# EAGLE schematic 808_handclap (EAGLE 7.6.0)
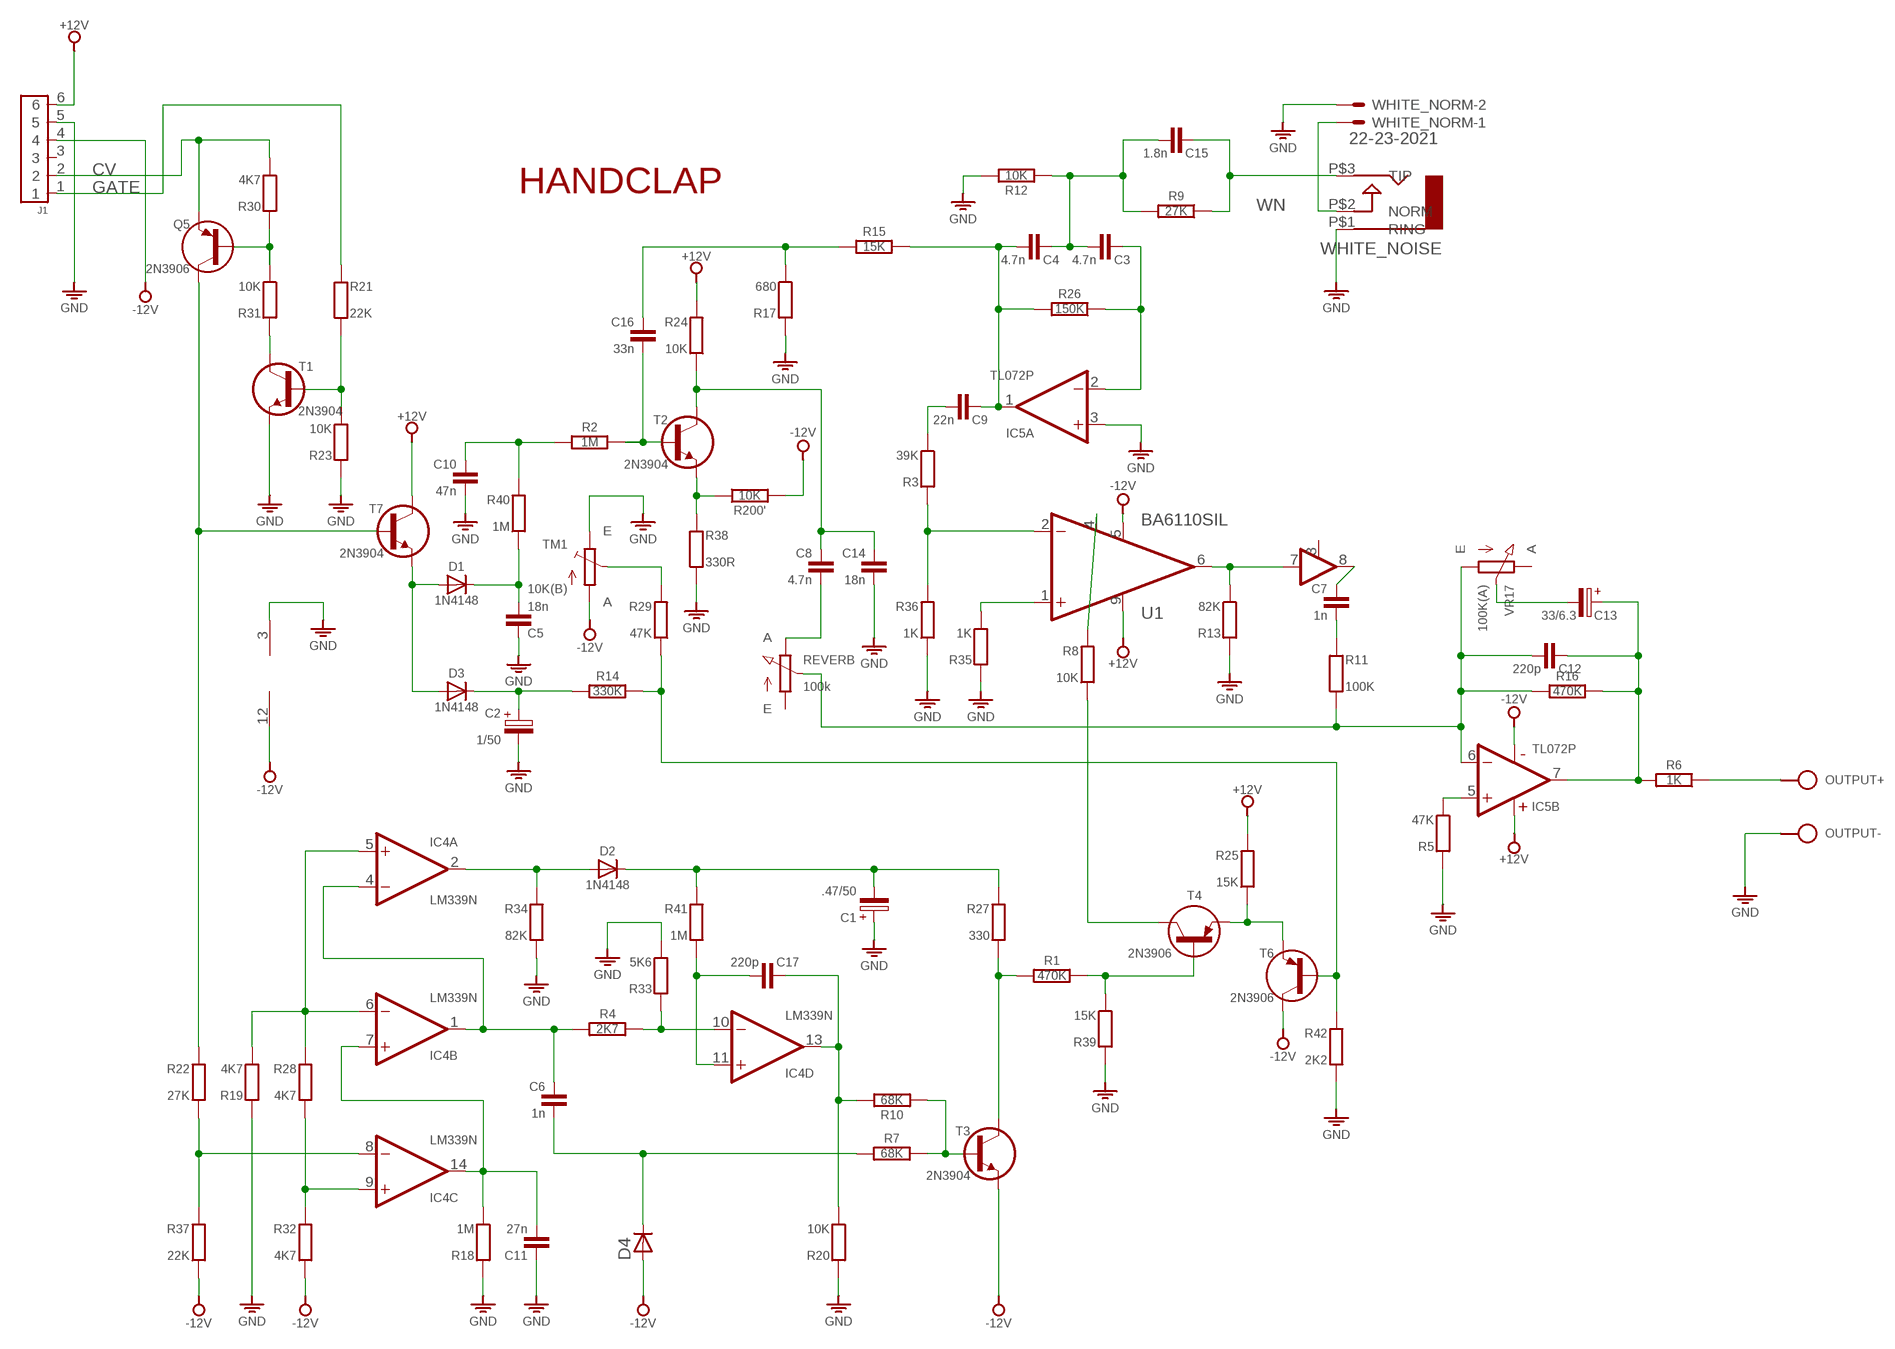
[diagram p0: schematic, sheet 1]

## Parts
C1  .47/50  CPOLE2,5-3/V  [E2,5-3/V]
C2  1/50  CPOLE2,5-4/V  [E2.5-4/V]
C3  4.7n  C-H050-020X044  [C050-020X044]
C4  4.7n  C-H050-020X044  [C050-020X044]
C5  18n  C050-020X044/V  [C050-020X044/V]
C6  1n  C050-020X044/V  [C050-020X044/V]
C7  1n  C050-020X044/V  [C050-020X044/V]
C8  4.7n  C050-020X044/V  [C050-020X044/V]
C9  22n  C-H050-020X044  [C050-020X044]
C10  47n  C050-020X044/V  [C050-020X044/V]
C11  27n  C050-020X044/V  [C050-020X044/V]
C12  220p  C-H050-020X044  [C050-020X044]
C13  33/6.3  CPOL-HE2,5-3  [E2,5-3]
C14  18n  C050-020X044/V  [C050-020X044/V]
C15  1.8n  C-H050-020X044  [C050-020X044]
C16  33n  C050-020X044/V  [C050-020X044/V]
C17  220p  C-H050-020X044  [C050-020X044]
D1  1N4148  DIODE-HDO34-10  [DO34-10]
D2  1N4148  DIODE-HDO34-10  [DO34-10]
D3  1N4148  DIODE-HDO34-10  [DO34-10]
D4  1N4148DO35-7  [DO35-7]
IC3  LM339N  [DIL14]
IC4  LM339N  [DIL14]
IC5  TL072P  [DIL08]
J1  CONN-6P  [CONN-6P]
OUTPUT  SPAD+-+-  [SPAD+-]
Q5  2N3906  [TO92]
R1  470K  R-H0204/10  [0204/10]
R2  1M  R-H0204/10  [0204/10]
R3  39K  R0204/10-V  [0204/10-V]
R4  2K7  R-H0204/10  [0204/10]
R5  47K  R0204/10-V  [0204/10-V]
R6  1K  R-H0204/10  [0204/10]
R7  68K  R-H0204/10  [0204/10]
R8  10K  R0204/10-V  [0204/10-V]
R9  27K  R-H0204/10  [0204/10]
R10  68K  R-H0204/10  [0204/10]
R11  100K  R0204/10-V  [0204/10-V]
R12  10K  R-H0204/10  [0204/10]
R13  82K  R0204/10-V  [0204/10-V]
R14  330K  R-H0204/10  [0204/10]
R15  15K  R-H0204/10  [0204/10]
R16  470K  R-H0204/10  [0204/10]
R17  680  R0204/10-V  [0204/10-V]
R18  1M  R0204/10-V  [0204/10-V]
R19  4K7  R0204/10-V  [0204/10-V]
R20  10K  R0204/10-V  [0204/10-V]
R21  22K  R0204/10-V  [0204/10-V]
R22  27K  R0204/10-V  [0204/10-V]
R23  10K  R0204/10-V  [0204/10-V]
R24  10K  R0204/10-V  [0204/10-V]
R25  15K  R0204/10-V  [0204/10-V]
R26  150K  R-H0204/10  [0204/10]
R27  330  R0204/10-V  [0204/10-V]
R28  4K7  R0204/10-V  [0204/10-V]
R29  47K  R0204/10-V  [0204/10-V]
R30  4K7  R0204/10-V  [0204/10-V]
R31  10K  R0204/10-V  [0204/10-V]
R32  4K7  R0204/10-V  [0204/10-V]
R33  5K6  R0204/10-V  [0204/10-V]
R34  82K  R0204/10-V  [0204/10-V]
R35  1K  R0204/10-V  [0204/10-V]
R36  1K  R0204/10-V  [0204/10-V]
R37  22K  R0204/10-V  [0204/10-V]
R38  330R  R0204/10-V  [0204/10-V]
R39  15K  R0204/10-V  [0204/10-V]
R40  1M  R0204/10-V  [0204/10-V]
R41  1M  R0204/10-V  [0204/10-V]
R42  2K2  R0204/10-V  [0204/10-V]
R200'  10K  R-H0204/10  [0204/10]
REVERB  100k  POT  [POT]
T1  2N3904  [TO92]
T2  2N3904  [TO92]
T3  2N3904  [TO92]
T4  2N3906  2N3906-H  [TO92]
T6  2N3906  [TO92]
T7  2N3904  [TO92]
TM1  10K(B)  TRIMR-TRIM  [R-TRIM]
U1  BA6110SIL  [SIL09]
VR17  100K(A)  POT  [POT]
WHITE_NOISE  AUDIO-JACK  [ERTHENVAR-JACK-90DEG]
WHITE_NORM  22-23-2021  [22-23-2021]

## Nets
+12V [Power]: IC5.8(P:V+) J1.6 R24.1 R25.1 T7.3(C) U1.9(V+)
-12V: D4.A IC3.12(P:GND) IC5.4(P:V-) J1.4 R32.2 R37.2 R200'.2 T3.1(E) T6.3(C) TM1.1(A) U1.5(V-)
CV: J1.2 Q5.1(E) R30.2
GATE: J1.1 R21.1
GND [GND]: C1.+ C2.- C5.1 C10.2 C11.1 C14.2 IC3.3(P:V+) IC5.3(A:+IN) J1.5 OUTPUT.1 R5.1 R12.1 R13.1 R17.1 R18.1 R19.1 R20.1 R23.1 R33.2 R34.2 R35.1 R36.2 R38.2 R39.1 R42.2 T1.1(E) TM1.3(E) WHITE_NOISE.P$1(RING) WHITE_NORM.2
N$1: OUTPUT.2 R6.1
N$2: WHITE_NOISE.P$2(NORM) WHITE_NORM.1
N$3: R31.1 T1.3(C)
N$4: R21.2 R23.2 T1.2(B)
N$10: C4.2 C9.1 IC5.1(A:OUT) R15.1 R26.2
N$37: Q5.2(B) R30.1 R31.2
N$40: C16.2 R2.1 T2.2(B)
N$41: C5.2 D1.C R40.2
N$42: R38.1 R200'.1 T2.1(E)
N$43: Q5.3(C) R22.1 T7.2(B)
N$44: D1.A D3.A T7.1(E)
N$45: C10.1 R2.2 R40.1
N$46: C8.1 C14.1 R24.2 T2.3(C)
N$47: C2.+ D3.C R14.2
N$48: R14.1 R29.2 R42.1 T6.2(B)
N$49: R29.1 TM1.2(S)
N$50: C16.1 R15.2 R17.2
N$51: D2.A IC4.2(A:OUT) R34.1
N$52: C3.2 C4.1 C15.2 R9.2 R12.2
N$54: C3.1 IC5.2(A:-IN) R26.1
N$55: C9.2 R3.2
N$56: R3.1 R36.1 U1.2(-IN)
N$57: C8.2 REVERB.E
N$59: R35.2 U1.1(+IN)
N$60: R8.1 U1.4(C)
N$61: R13.2 U1.6(OUT) U1.7(IN1)
N$62: C7.2 R11.1
N$63 [special]: C7.1 U1.8(OUT1)
N$64: IC4.5(A:+IN) IC4.6(B:-IN) R19.2 R28.1
N$65: C1.- D2.C R27.1 R41.1
N$66: R1.1 R39.2 T4.2(B)
N$67: R25.2 T4.1(E) T6.1(E)
N$68: C6.1 IC4.1(B:OUT) IC4.4(A:-IN) R4.2
N$69: R8.2 T4.3(C)
N$70: R1.2 R27.2 T3.3(C)
N$71: IC4.9(C:+IN) R28.2 R32.1
N$72: C17.2 IC4.11(D:+IN) R41.2
N$73: IC4.10(D:-IN) R4.1 R33.1
N$74: IC4.8(C:-IN) R22.2 R37.1
N$75: R7.1 R10.2 T3.2(B)
N$76: C6.2 D4.C R7.2
N$77: C11.2 IC4.7(B:+IN) IC4.14(C:OUT) R18.2
N$78: C17.1 IC4.13(D:OUT) R10.1 R20.2
N$91: IC5.5(B:+IN) R5.2
N$92 [special]: C12.2 IC5.6(B:-IN) R11.2 R16.2 REVERB.S VR17.A
N$95: C13.- VR17.S
N$97: C12.1 C13.+ IC5.7(B:OUT) R6.2 R16.1
WN: C15.1 R9.1 WHITE_NOISE.P$3(TIP)
Unconnected: IC3.1(B:OUT) IC3.2(A:OUT) IC3.4(A:-IN) IC3.5(A:+IN) IC3.6(B:-IN) IC3.7(B:+IN) IC3.8(C:-IN) IC3.9(C:+IN) IC3.10(D:-IN) IC3.11(D:+IN) IC3.13(D:OUT) IC3.14(C:OUT) J1.3 REVERB.A U1.3 VR17.E

## Notes on the sheet
- HANDCLAP

## Power pins joined to a net without a drawn wire
V+: IC4.3(5:V+)
V-: IC4.12(5:V-)

## Library data of the parts
C1 C2 = c:CPOL: POLARIZED CAPACITOR, European symbol
C3 C4 C9 C12 C15 C17 = c:C-H
C5-C8 C10 C11 C14 C16 = c:C: CAPACITOR, European symbol
C13 = c:CPOL-H
D1-D3 = d:DIODE-H
D4 = TR808clone:1N4148: DIODE high speed (Philips)
IC3 = linear:LM339: Low Power Low Offset Voltage Quad Comparators with open collector; LM139/LM239/LM339/LM2901/LM3302
IC4 = ic:LM339
IC5 = ic:TL072: Low-Noise JFET-Input Operational Amplifiers http://www.ti.com/lit/ds/symlink/tl072.pdf
J1 = pinconn:CONN-6P
OUTPUT = pad:SPAD+-
Q5 T6 = t:2N3906
R1 R2 R4 R6 R7 R9 R10 R12 R14-R16 R26 R200' = r:R-H
R3 R5 R8 R11 R13 R17-R25 R27-R42 = r:R: RESISTOR, European symbol
REVERB VR17 = r:POT
T1-T3 T7 = t:2N3904
T4 = t:2N3906-H
TM1 = r:TRIM: POTENTIOMETER
U1 = TR808clone:BA6110
WHITE_NOISE = erthenvar:AUDIO-JACK: Switching Mono 3.5mm Audio Jack from Erthenvar.
WHITE_NORM = con-molex:22-23-2021: .100" (2.54mm) Center Header - 2 Pin; MF: MOLEX; MPN: 22-23-2021; OC_FARNELL: 1462926; OC_NEWARK: 25C3832

## Net classes
0 default: width 0.635 mm, drill 0.254 mm, clearance 0.254 mm
1 GND: width 1.016 mm, drill 1.016 mm, clearance 0.508 mm
2 Power: width 1.016 mm, drill 1.016 mm, clearance 0.508 mm
3 special: width 0.635 mm, drill 0.254 mm, clearance 0.254 mm
4 15v: width 1.524 mm, drill 1.016 mm, clearance 0.508 mm